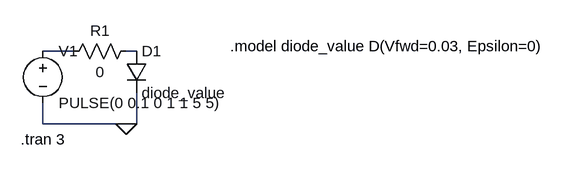
[diagram p0: schematic test_diode.asc]
test_diode.asc, the LTspice schematic file:
Version 4
SHEET 1 880 680
WIRE 0 160 -48 160
WIRE 96 160 80 160
WIRE -48 272 -48 240
WIRE 80 272 -48 272
WIRE 96 272 96 224
WIRE 96 272 80 272
FLAG 80 272 0
SYMBOL diode 80 160 R0
SYMATTR InstName D1
SYMATTR Value diode_value
SYMBOL voltage -48 144 R0
WINDOW 123 0 0 Left 0
WINDOW 39 0 0 Left 0
SYMATTR InstName V1
SYMATTR Value PULSE(0 0.1 0 1 1 5 5)
SYMBOL res 96 144 R90
WINDOW 0 0 56 VBottom 2
WINDOW 3 32 56 VTop 2
SYMATTR InstName R1
SYMATTR Value 0
TEXT -82 296 Left 2 !.tran 3
TEXT 240 152 Left 2 !.model diode_value D(Vfwd=0.03, Epsilon=0)

The netlist it stands for:
* test_diode.asc
D1 N002 0 diode_value
V1 N001 0 PULSE(0 0.1 0 1 1 5 5)
R1 N002 N001 0
.model D D
.lib standard.dio
.tran 3
.model diode_value D(Vfwd=0.03, Epsilon=0)
.backanno
.end